# Altium schematic sheet SummingAmplifier.SchDoc: Summing Amplifier
size A; SheetNumber: 6; SheetTotal: 7
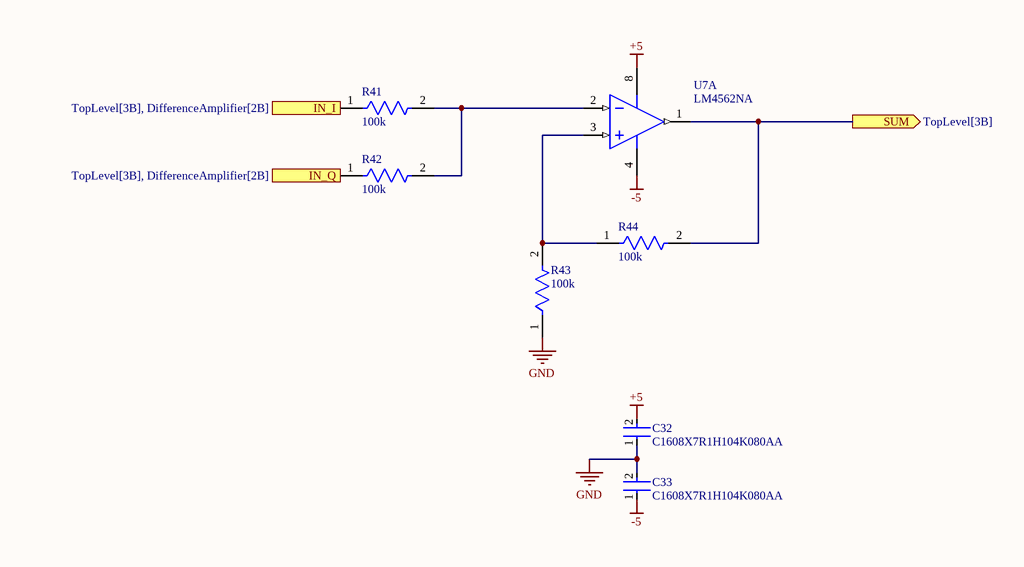
[diagram p0: SummingAmplifier.SchDoc]

## Parts
C32  C1608X7R1H104K080AA  [FP-C1608-080-0_1-MFG]
C33  C1608X7R1H104K080AA  [FP-C1608-080-0_1-MFG]
R41  100k  [FP-RC0805-0_6-IPC_C]
R42  100k  [FP-RC0805-0_6-IPC_C]
R43  100k  [FP-RC0805-0_6-IPC_C]
R44  100k  [FP-RC0805-0_6-IPC_C]
U7  LM4562NA  [N08E]  (part A of 2)

## Ports
IN_I (in, see TopLevel[3B], DifferenceAmplifier[2B]), IN_Q (in, see TopLevel[3B], DifferenceAmplifier[2B]), SUM (out, see TopLevel[3B])

## Nets
+5: C32.2 U7.8(V+)
-5: C33.1 U7.4(V-)
GND: C32.1 C33.2 R43.1
IN_I: R41.1 ; port IN_I
IN_Q: R42.1 ; port IN_Q
SUM: R44.2 U7.1(OUT_A) ; port SUM
NetR41_2: R41.2 R42.2 U7.2(IN_A)
NetR43_2: R43.2 R44.1 U7.3(IN_A)

## Library data of the parts
C32 C33 = CMP-2000-04982-2: Multilayer Ceramic Capacitors 100nF ±10% 50V X7R SMD 0603; REACH SVHC: No SVHC; Voltage: 50V; Min Operating Temperature: -55°C; Package Quantity: 1; Case Code (Metric): 1608; Series: C; Termination: SMD/SMT; Length: 1.6mm; Voltage Rating: 50V; Case Code (Imperial): 0603; Number of Pins: 2; RoHS Compliant: Yes; Thickness: 0.037inch; Resistor Type: Ceramic; Radiation Hardening: No; Weight: 7.1E-05oz; Mount: Surface Mount; Capacitance: 100nF; Voltage Rating (DC): 50V; Construction: Flat; Tolerance: 10%; Lead Free: Lead Free; Case/Package: 0603; Max Operating Temperature: 125°C; Height: 0.8mm; Depth: 0.8mm; Packaging: Tape and Reel; Width: 0.031inch; Dielectric Material: Ceramic; Dielectric: X7R
R41-R44 = CMP-2100-03668-5: RES 100K OHM 1% 1/8W 0805; Power Rating: 125mW; Temperature Coefficient: 100ppm/°C; Voltage Rating (DC): 150V; Resistance: 100kR; Package Quantity: 1; Case/Package: 0805; Lead Pitch: 0.4mm; Case Code (Imperial): 0805; Construction: Rectangular; Number of Terminations: 2; RoHS Compliant: Yes; Max Power Dissipation: 125mW; Tolerance: 1%; Max Operating Temperature: 155°C; Resistance Tolerance: 1%; Lead Free: Lead Free; Packaging: Tape and Reel; Resistor Type: Thick Film; Min Operating Temperature: -55°C; Case Code (Metric): 2012; Series: RC; Technology: THICK FILM; Voltage Rating: 150V; Termination: SMD/SMT; Width: 0.049inch; Number of Pins: 2; Features: Moisture Resistant; Military Standard: Not; Length: 0.079inch; Depth: 1.25mm; Size Code: 0805; Height: 0.024inch
U7 = CMP-0057-00043-2: Dual High Performance, High Fidelity Audio Operational Amplifier, 8-pin MDIP; Manufacturer: National Semiconductor; PowerWise: Y; PackageTopMarking: NSUZXYTT*LM*4562NA; CompType: Audio IC; ComponentLink2Description: LM4562 Web Page; PinCount: 8; RoHS: Y; PackageReference: N08E; DatasheetVersion: Jan-2010; RevisionNote: Component URLs added; PackageVersion: revG, May-2006; Code_JEDEC: MS-001-BA; ComponentLink3URL: http://www.national.com/packaging/folders/n08e.html; ComponentLink1Description: LM4562 Datasheet; PackageDescription: MDIP, .365 x .250 x .130in, 8 Lead, .100in Pitch; ComponentLink3Description: N08E Package Page; ComponentLink1URL: http://www.national.com/ds/LM/LM4562.pdf; ComponentLink2URL: http://www.national.com/pf/LM/LM4562.html